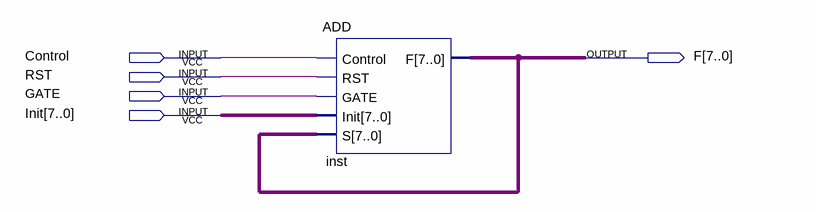
[diagram p0: schematic sheet]
// Quartus schematic ADDTest.bdf as structural Verilog: 1 symbols, 5 pins
module ADDTest (
  input  Control,
  input  RST,
  input  GATE,
  input  [7:0] Init,
  output [7:0] F
);

  ADD inst (.Control(Control), .RST(RST), .GATE(GATE), .Init(Init), .S(F), .F(F));
endmodule
